# Altium schematic sheet Aux_Outputs.SchDoc: RP2040 CNC
size B; Author: AM; CompanyName: Expatria Technologies; DrawnBy: A.Marles; Engineer: AM; Organization: Expatria Technolgoies; DocumentNumber: 10; SheetNumber: 10; SheetTotal: 14
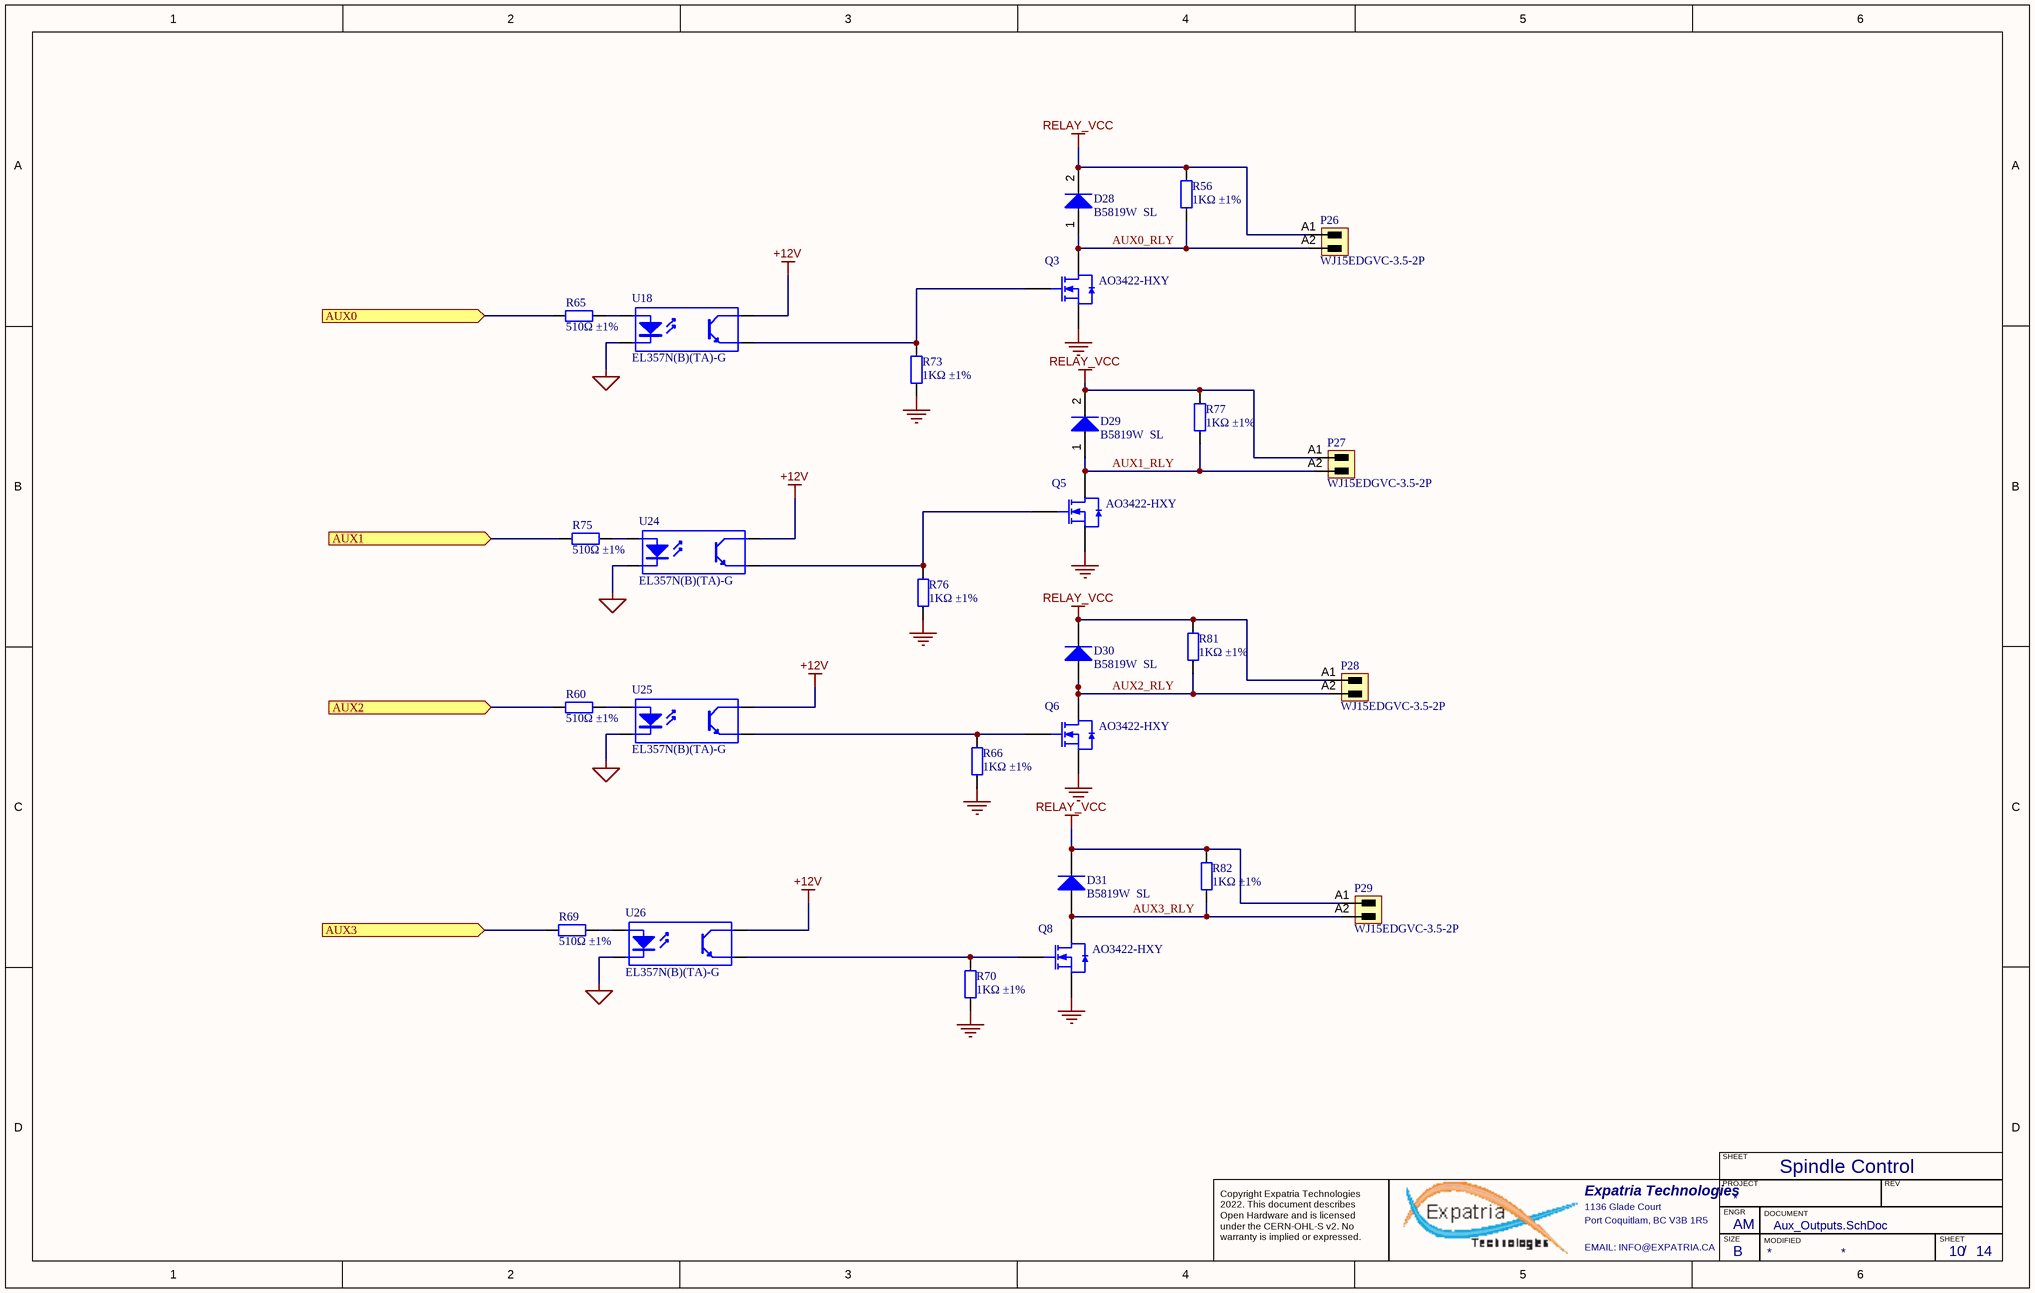
[diagram p0: Aux_Outputs.SchDoc]

## Parts
D28  B5819W  SL  [SOD-123]
D29  B5819W  SL  [SOD-123]
D30  B5819W  SL  [SOD-123]
D31  B5819W  SL  [SOD-123]
P26  WJ15EDGVC-3.5-2P  [691321100002]
P27  WJ15EDGVC-3.5-2P  [691321100002]
P28  WJ15EDGVC-3.5-2P  [691321100002]
P29  WJ15EDGVC-3.5-2P  [691321100002]
Q3  AO3422-HXY  [SOT-23-3L]
Q5  AO3422-HXY  [SOT-23-3L]
Q6  AO3422-HXY  [SOT-23-3L]
Q8  AO3422-HXY  [SOT-23-3L]
R56  1KΩ ±1%  [0603_R]
R60  510Ω ±1%  [0603_R]
R65  510Ω ±1%  [0603_R]
R66  1KΩ ±1%  [0603_R]
R69  510Ω ±1%  [0603_R]
R70  1KΩ ±1%  [0603_R]
R73  1KΩ ±1%  [0603_R]
R75  510Ω ±1%  [0603_R]
R76  1KΩ ±1%  [0603_R]
R77  1KΩ ±1%  [0603_R]
R81  1KΩ ±1%  [0603_R]
R82  1KΩ ±1%  [0603_R]
U18  EL357N(B)(TA)-G  [SOP-4_P2.54]
U24  EL357N(B)(TA)-G  [SOP-4_P2.54]
U25  EL357N(B)(TA)-G  [SOP-4_P2.54]
U26  EL357N(B)(TA)-G  [SOP-4_P2.54]

## Ports
AUX0 (in), AUX1 (in), AUX2 (in), AUX3 (in)

## Nets
+12V: U18.4(C) U24.4(C) U25.4(C) U26.4(C)
GND: Q3.2(S) Q5.2(S) Q6.2(S) Q8.2(S) R66.1 R70.1 R73.1 R76.1
MCU_GND: U18.2(K) U24.2(K) U25.2(K) U26.2(K)
RELAY_VCC: D28.2(K) D29.2(K) D30.2(K) D31.2(K) P26.A1 P27.A1 P28.A1 P29.A1 R56.2 R77.2 R81.2 R82.2
AUX0: R65.1 ; port AUX0
AUX0_RLY: D28.1(A) P26.A2 Q3.3(D) R56.1
AUX1: R75.1 ; port AUX1
AUX1_RLY: D29.1(A) P27.A2 Q5.3(D) R77.1
AUX2: R60.1 ; port AUX2
AUX2_RLY: D30.1(A) P28.A2 Q6.3(D) R81.1
AUX3: R69.1 ; port AUX3
AUX3_RLY: D31.1(A) P29.A2 Q8.3(D) R82.1
NetQ3_1: Q3.1(G) R73.2 U18.3(E)
NetQ5_1: Q5.1(G) R76.2 U24.3(E)
NetQ6_1: Q6.1(G) R66.2 U25.3(E)
NetQ8_1: Q8.1(G) R70.2 U26.3(E)
NetR60_2: R60.2 U25.1(A)
NetR65_2: R65.2 U18.1(A)
NetR69_2: R69.2 U26.1(A)
NetR75_2: R75.2 U24.1(A)

## Notes on the sheet
- Spindle Control
- SHEET
- Expatria Technologies
- 1136 Glade Court
- Port Coquitlam, BC V3B 1R5
- PROJECT
- SIZE
- ENGR
- MODIFIED
- DOCUMENT
- REV
- Copyright Expatria Technologies 2022. This document describes Open Hardware and is licensed under the CERN-OHL-S v2. No warranty is implied or expressed.
- EMAIL: INFO@EXPATRIA.CA
- B
- /

## Library data of the parts
D28-D31 = SOD-123 B5819W  SL: Schottky Diode; ComponentLink1Description: 供应商链接; ComponentLink1URL: http://www.szlcsc.com/product/details_9093.html; Package: SOD-123; Supplier: LC; SuppliersPartNumber: C8598
P26-P29 = 3.5mm Terminal Header 2p: Header,Male Pin,Covered(4 Sided) 2 1 0.138"（3.50mm） 2 P=3.5mm Pluggable System Terminal Block RoHS; Manufacturer: Weidmueller; Manufacturer 1: Weidmuller; Manufacturer Part Number 1: 1604470000; UL_94_flammability_rating: V-0; Pitch_mm: 3.5 mm; Side_termination_characteristic: closed side; Pitch_inch: 0.138 inch; Solder_pin_length_mm: 3.2 mm; Short_text_for_material: SL 3.50/02/180G 3.2SN OR BX; ComponentLink1Description: Manufacturer URL; ComponentLink1URL: http://www.weidmueller.com/; PartNumber: WJ15EDGVC-3.5-2P; Revision: V1; PackageReference: SL_3_50_180G_02; Packaging: Box; SuppliersPartNumber: C192777
Q3 Q5 Q6 Q8 = AO3400A N道沟 X0YV1T SOT-23: 60V 4.5A 8W 75mΩ@10V,5A 2.5V@250uA N Channel 695pF@15V SOT-23-3L MOSFETs ROHS; ComponentLink1Description: 供应商链接; ComponentLink1URL: http://www.szlcsc.com/product/details_21629.html; Package: SOT-23L; Supplier: LC; SuppliersPartNumber: C4748727
R56 R66 R70 R73 R76 R77 R81 R82 = 0603 1K (1001) 1%: Chip resistor; Manufacturer: Uniroyal Elec; PartNumber: 0603WAF1001T5E; Power: 1/10W; ComponentLink1Description: Supplier link; ComponentLink1URL: http://www.szlcsc.com/product/details_21904.html; Package: 0603; Supplier: LC; SuppliersPartNumber: C21190; Resistance: 1KΩ; Tolerance: 1%
R60 R65 R69 R75 = 0603 510R (5100) 1%: Chip resistor; Manufacturer: Uniroyal Elec; PartNumber: 0603WAF5100T5E; Power: 1/10W; ComponentLink1Description: Supplier link; ComponentLink1URL: http://www.szlcsc.com/product/details_23920.html; Package: 0603; Supplier: LC; SuppliersPartNumber: C23193; Resistance: 510Ω; Tolerance: 1%
U18 U24-U26 = EL357N(B)(TA)-G_[C6649]: Optocoupler SOP-4, EL357N(B)(TA)-G, Everlight Electronics; ComponentLink1Description: 供应商链接; ComponentLink1URL: http://www.szlcsc.com/product/details_7114.html; Package: SOP-4_P2.54; Supplier: LC; SuppliersPartNumber: C6649; Manufacturer 1: Everlight; Manufacturer Part Number 1: EL357N(B)(TA)-G